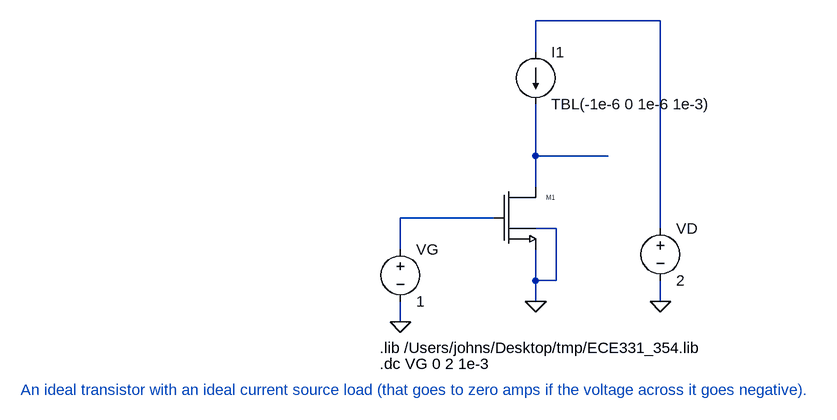
[diagram p0: schematic ideal_transistor_load.asc]
ideal_transistor_load.asc, the LTspice schematic file:
Version 4
SHEET 1 880 680
WIRE 352 -144 160 -144
WIRE 160 -96 160 -144
WIRE 160 64 160 -16
WIRE 272 64 160 64
WIRE 160 112 160 64
WIRE 96 160 -48 160
WIRE 192 176 160 176
WIRE 352 176 352 -144
WIRE -48 208 -48 160
WIRE 160 256 160 208
WIRE 192 256 192 176
WIRE 192 256 160 256
WIRE 160 288 160 256
WIRE 352 288 352 256
WIRE -48 320 -48 288
FLAG 160 288 0
FLAG -48 320 0
FLAG 352 288 0
SYMBOL ALD1101 96 112 R0
SYMATTR InstName M1
SYMATTR SpiceModel ""
SYMATTR SpiceLine ""
SYMATTR Value IDEAL_NMOS
SYMATTR Value2 l=1E-6 w=1E-3
SYMBOL voltage -48 192 R0
WINDOW 123 0 0 Left 2
WINDOW 39 0 0 Left 2
SYMATTR InstName VG
SYMATTR Value 1
SYMBOL voltage 352 160 R0
WINDOW 123 0 0 Left 2
WINDOW 39 0 0 Left 2
SYMATTR InstName VD
SYMATTR Value 2
SYMBOL current 160 -96 R0
SYMATTR InstName I1
SYMATTR Value TBL(-1e-6 0 1e-6 1e-3)
TEXT -80 360 Left 2 !.lib /Users/johns/Desktop/tmp/ECE331_354.lib
TEXT -80 384 Left 2 !.dc VG 0 2 1e-3
TEXT -632 424 Left 2 ;An ideal transistor with an ideal current source load (that goes to zero amps if the voltage across it goes negative).

The netlist it stands for:
* ideal_transistor_load.asc
M1 N002 N003 0 0 IDEAL_NMOS l=1E-6 w=1E-3
VG N003 0 1
VD N001 0 2
I1 N001 N002 TBL(-1e-6 0 1e-6 1e-3)
.model NMOS NMOS
.model PMOS PMOS
.lib standard.mos
.lib /Users/johns/Desktop/tmp/ECE331_354.lib
.dc VG 0 2 1e-3
* An ideal transistor with an ideal current source load (that goes to zero amps if the voltage across it goes negative).
.backanno
.end